# Altium project Hammer.PrjPCB (part 1 of 3)
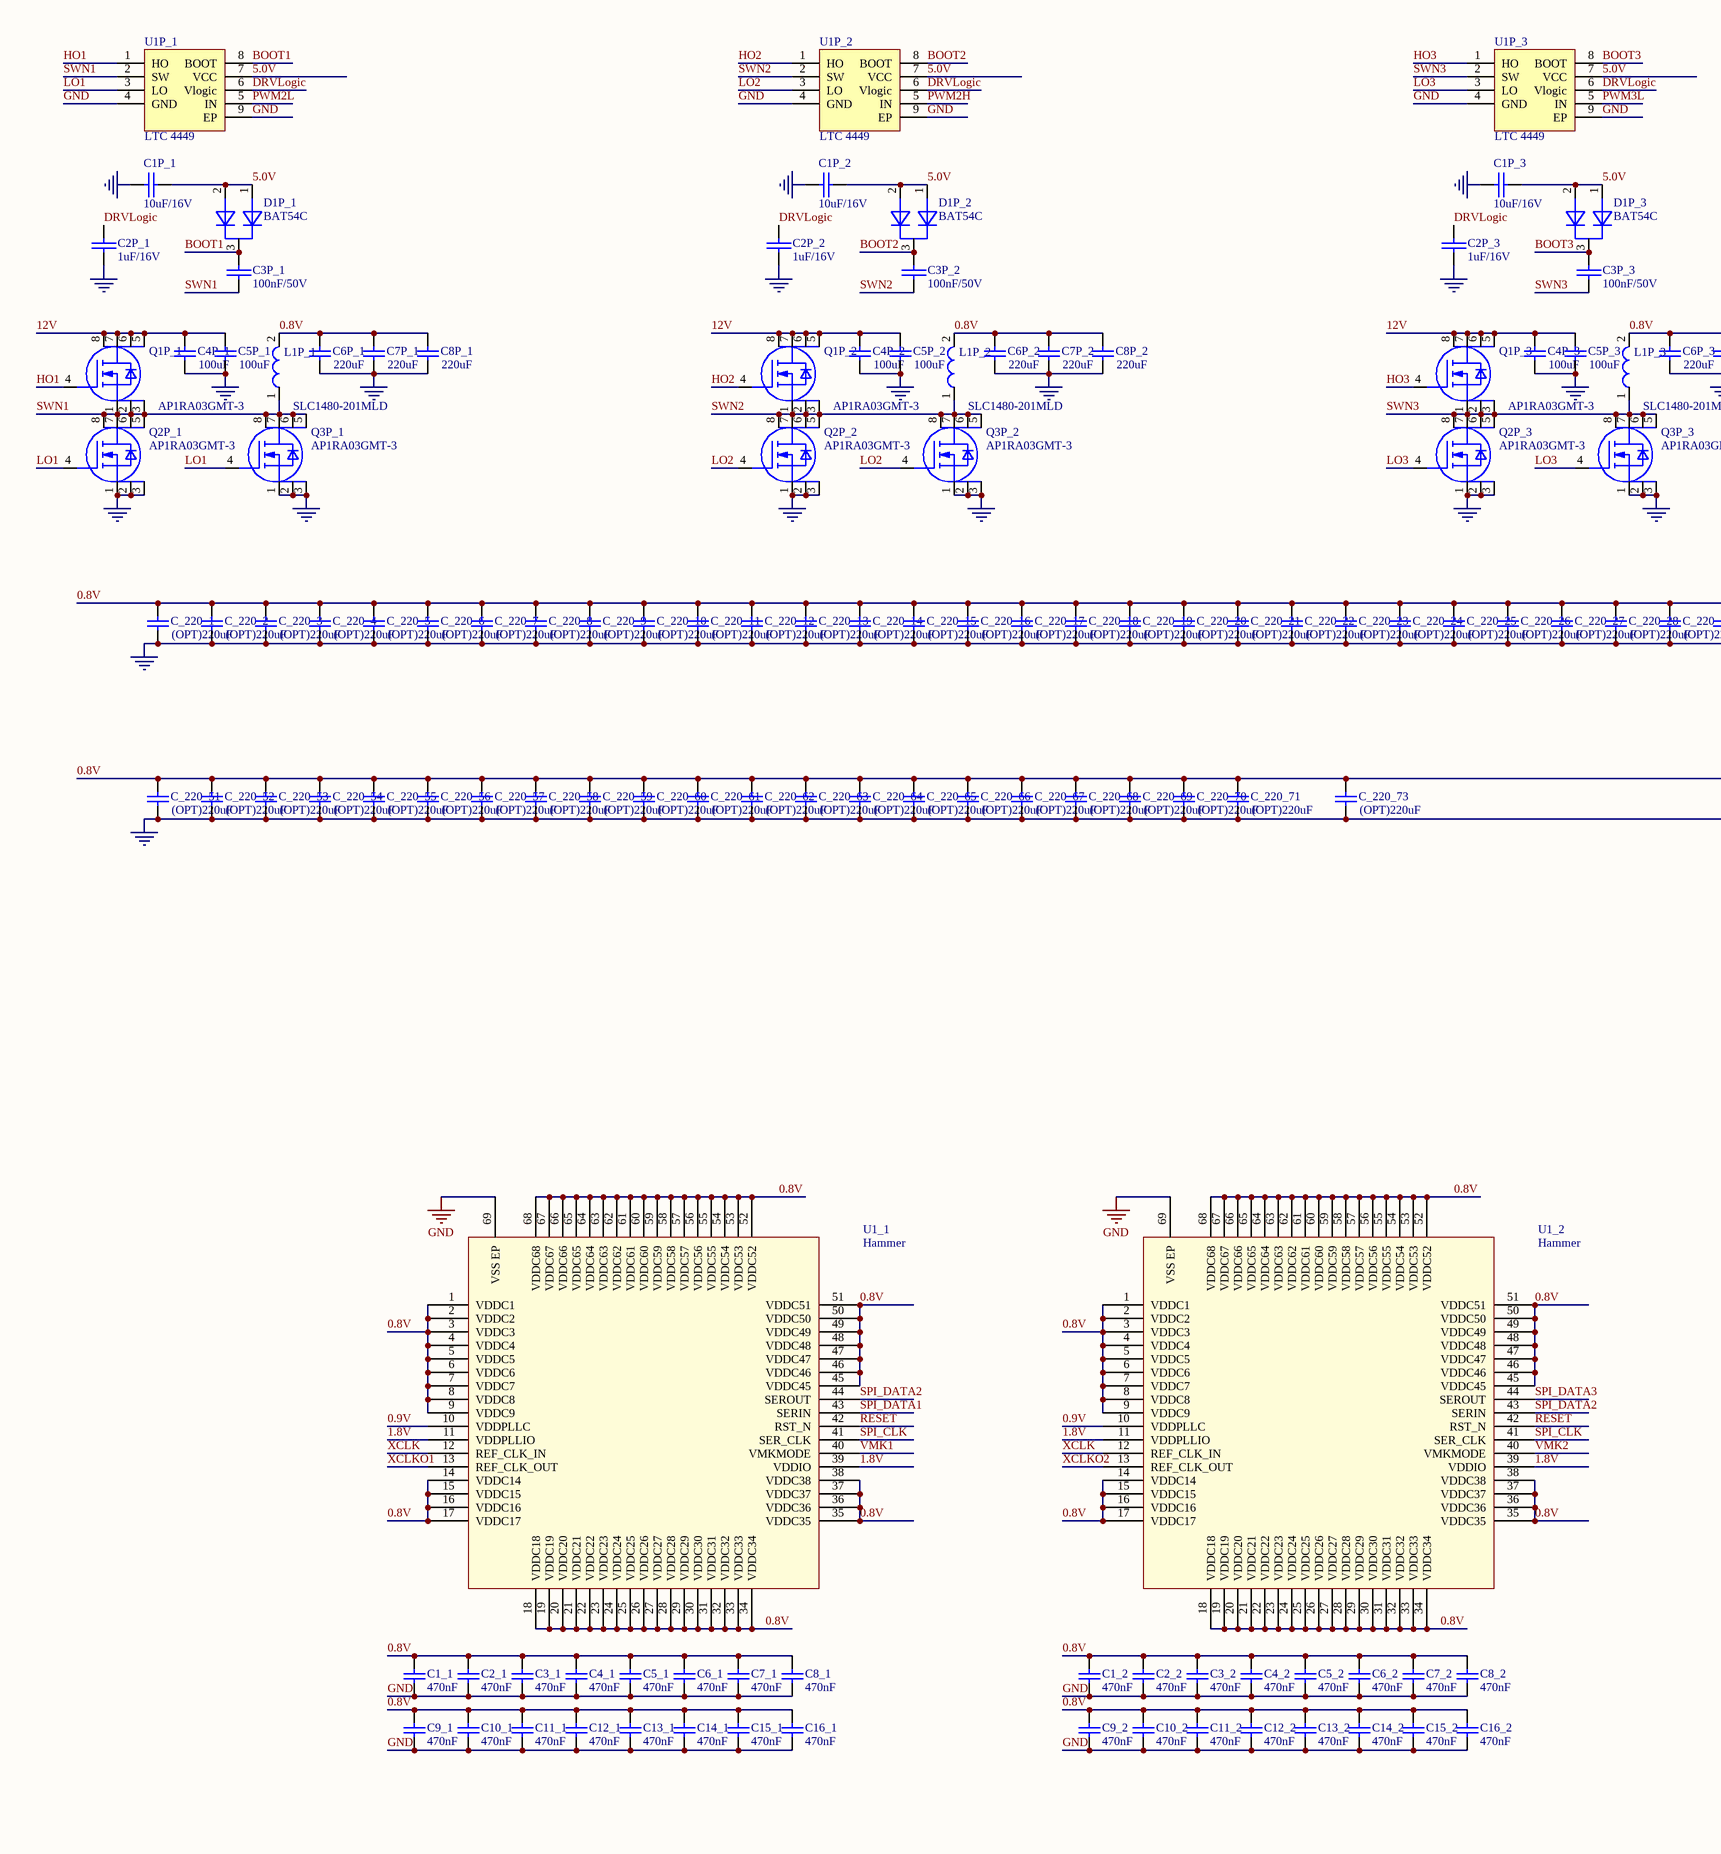
[diagram p0: Hammer.SchDoc, top left]
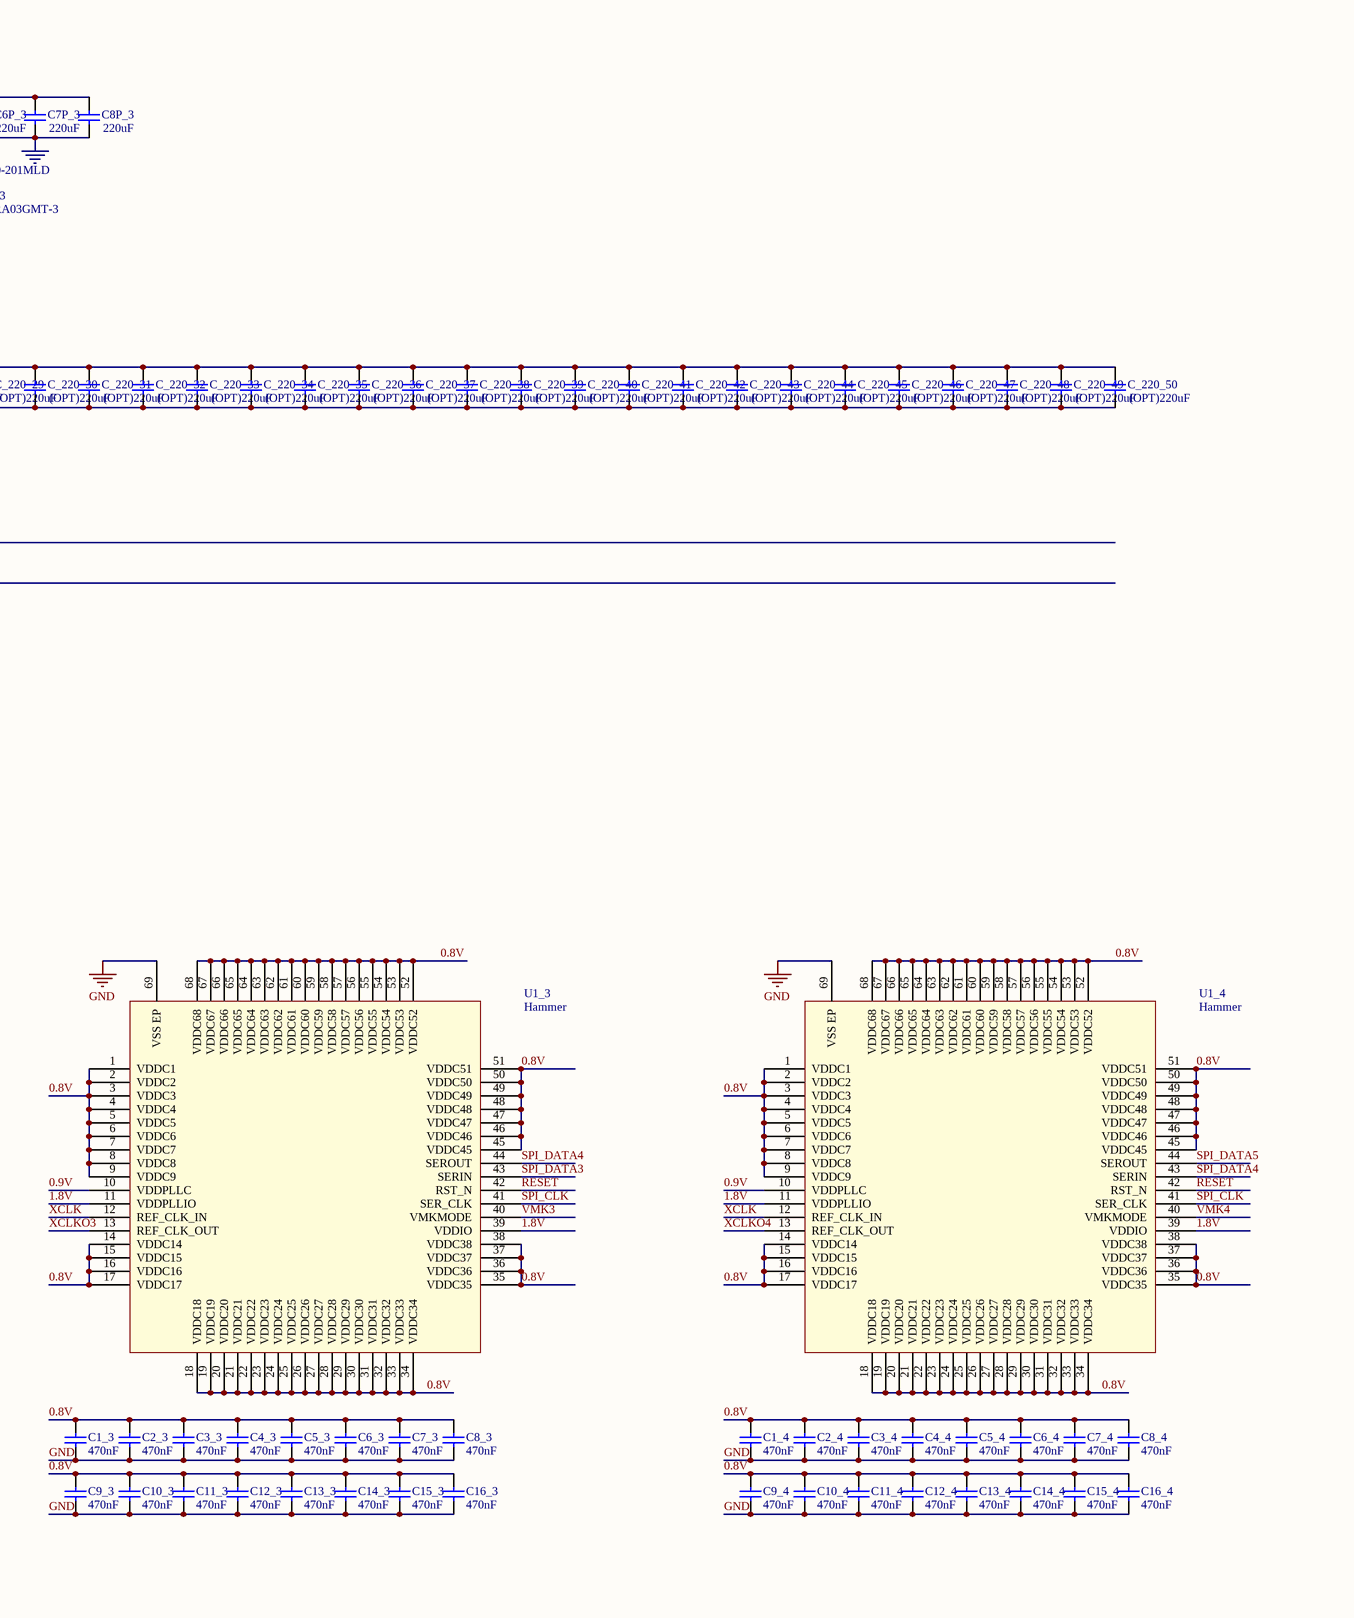
[diagram p1: Hammer.SchDoc, top middle]
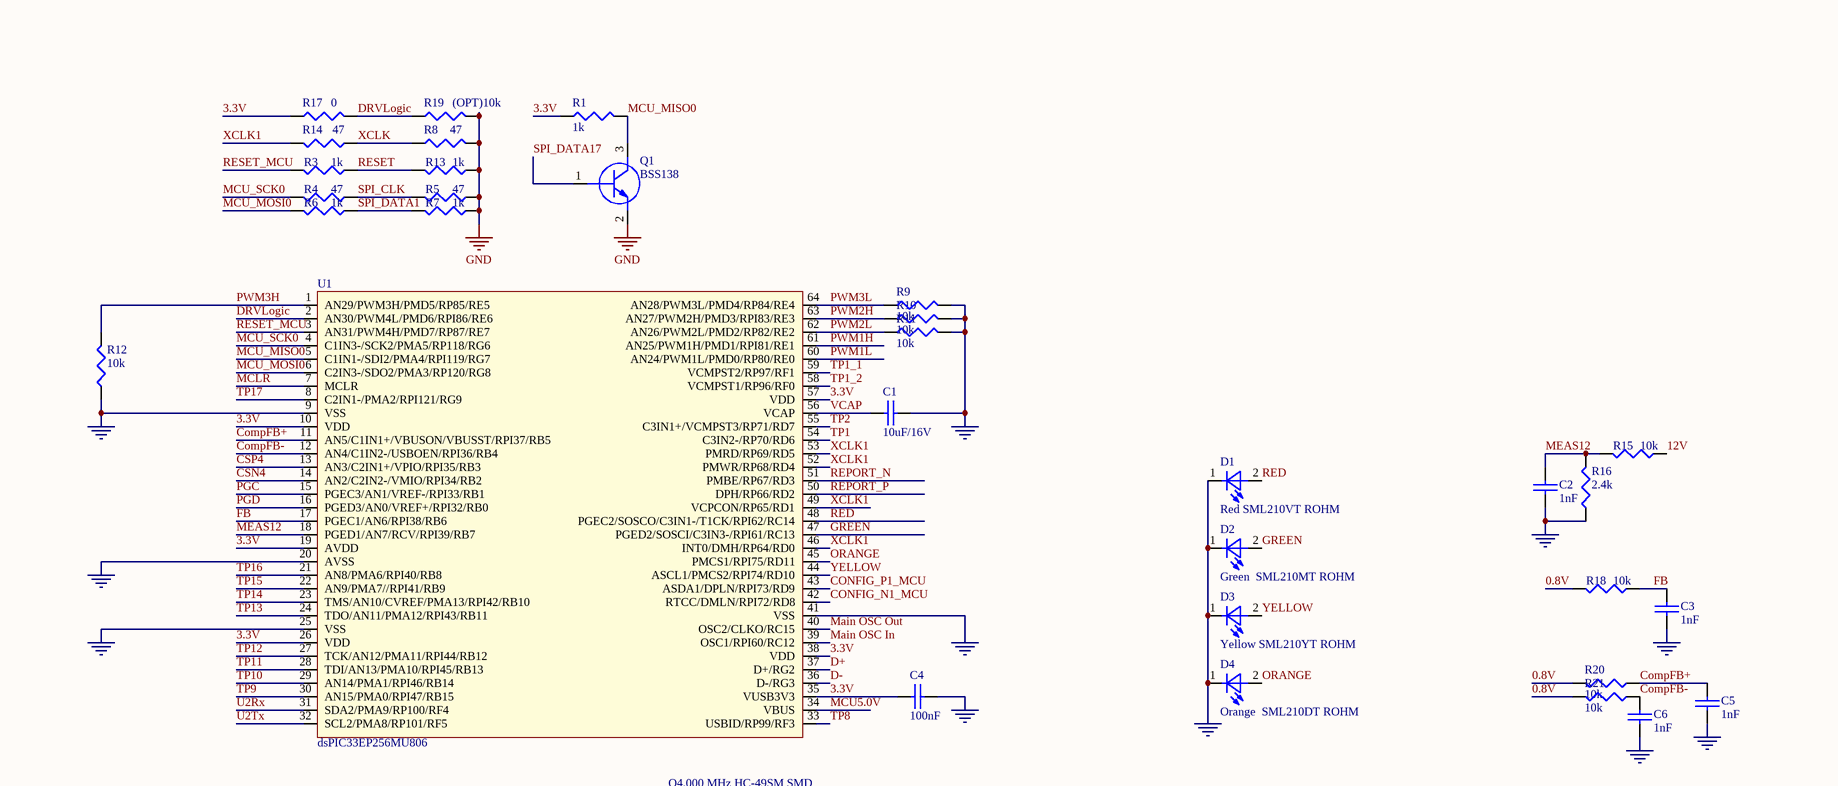
[diagram p2: Hammer.SchDoc, top right]
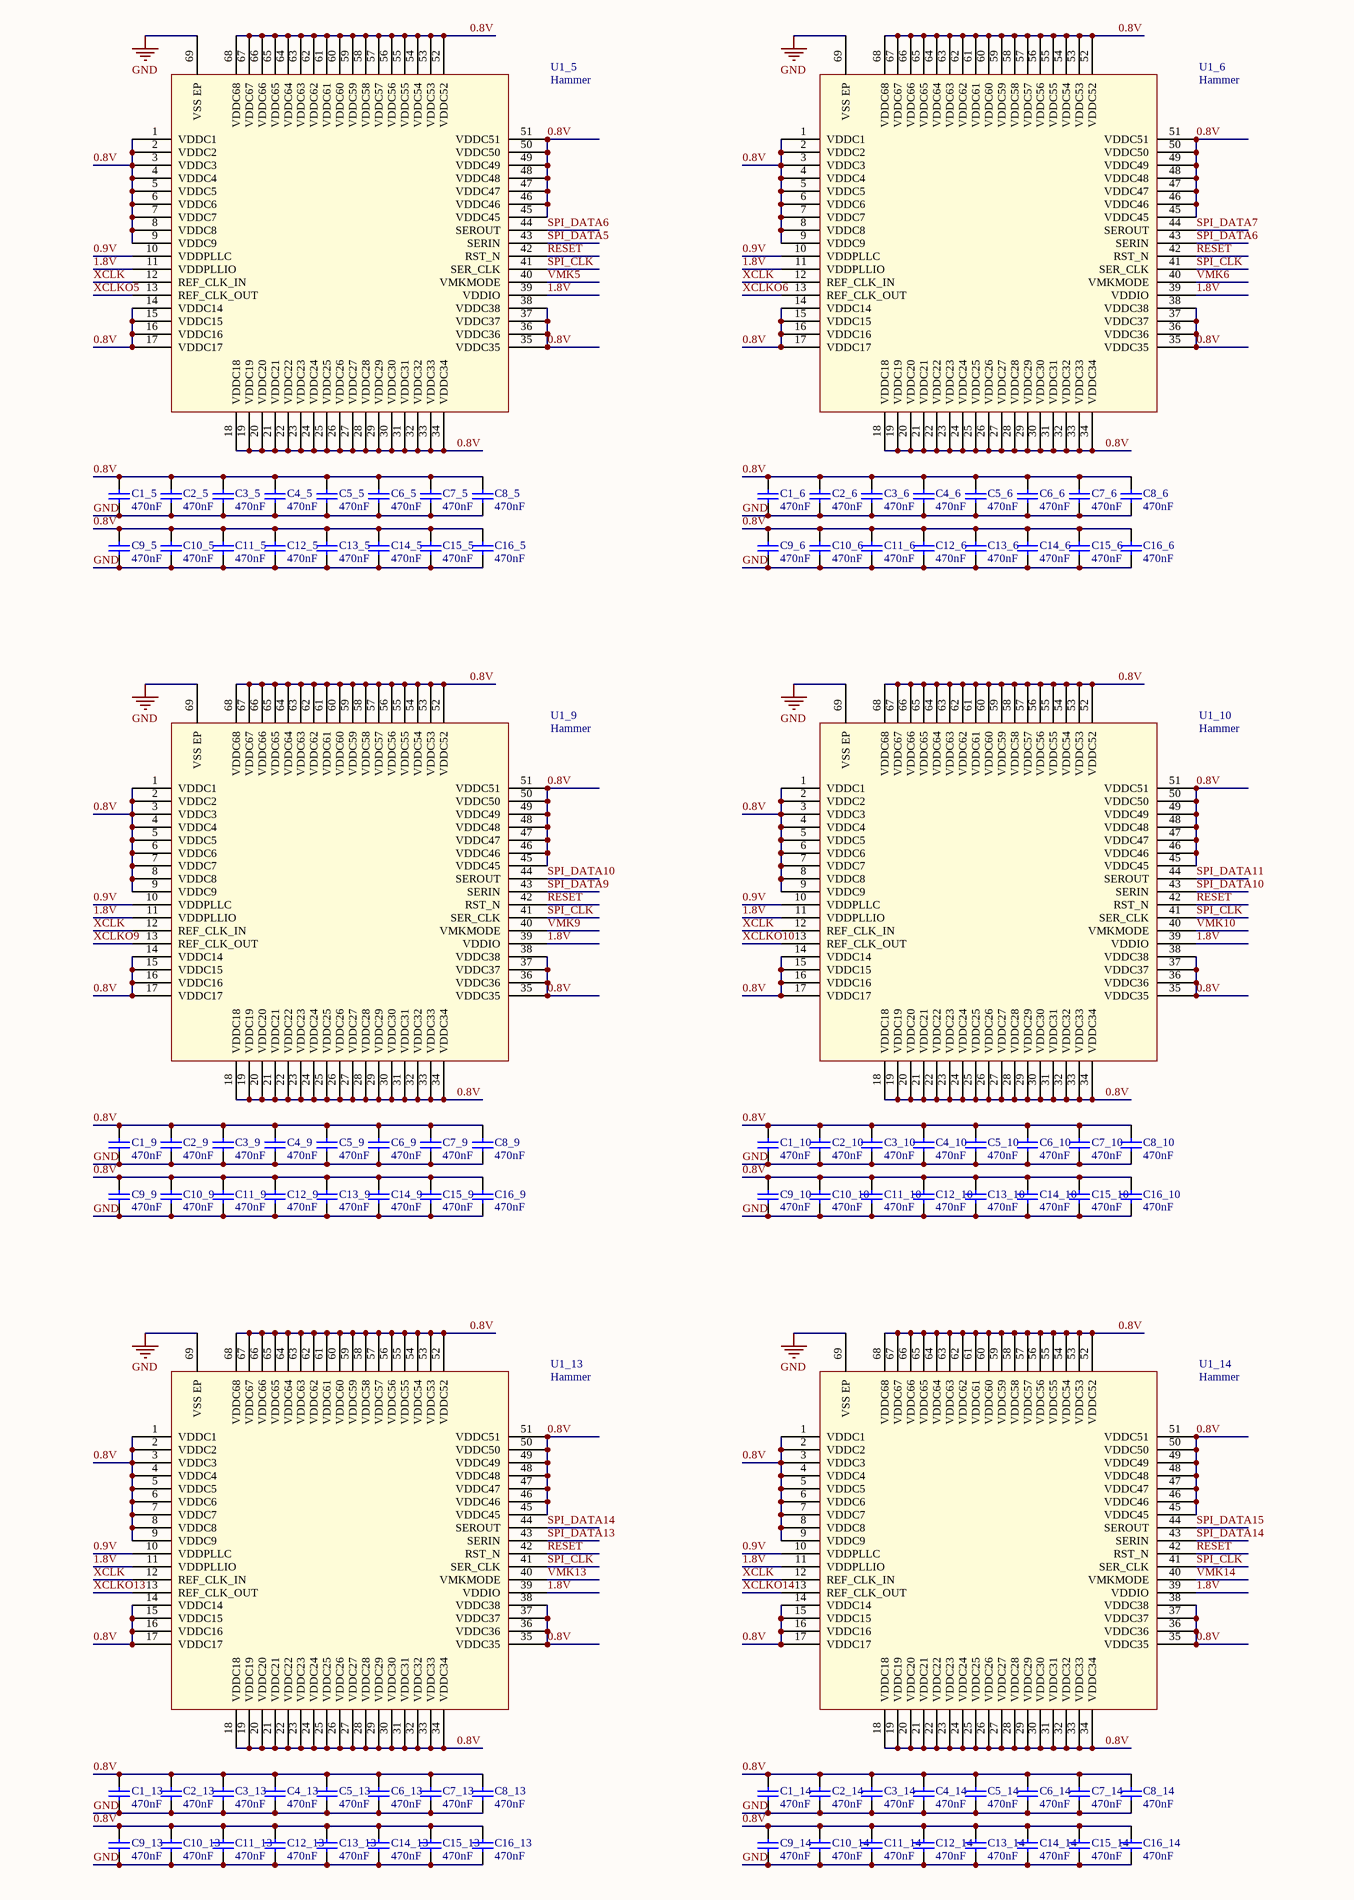
[diagram p3: Hammer.SchDoc, bottom left]
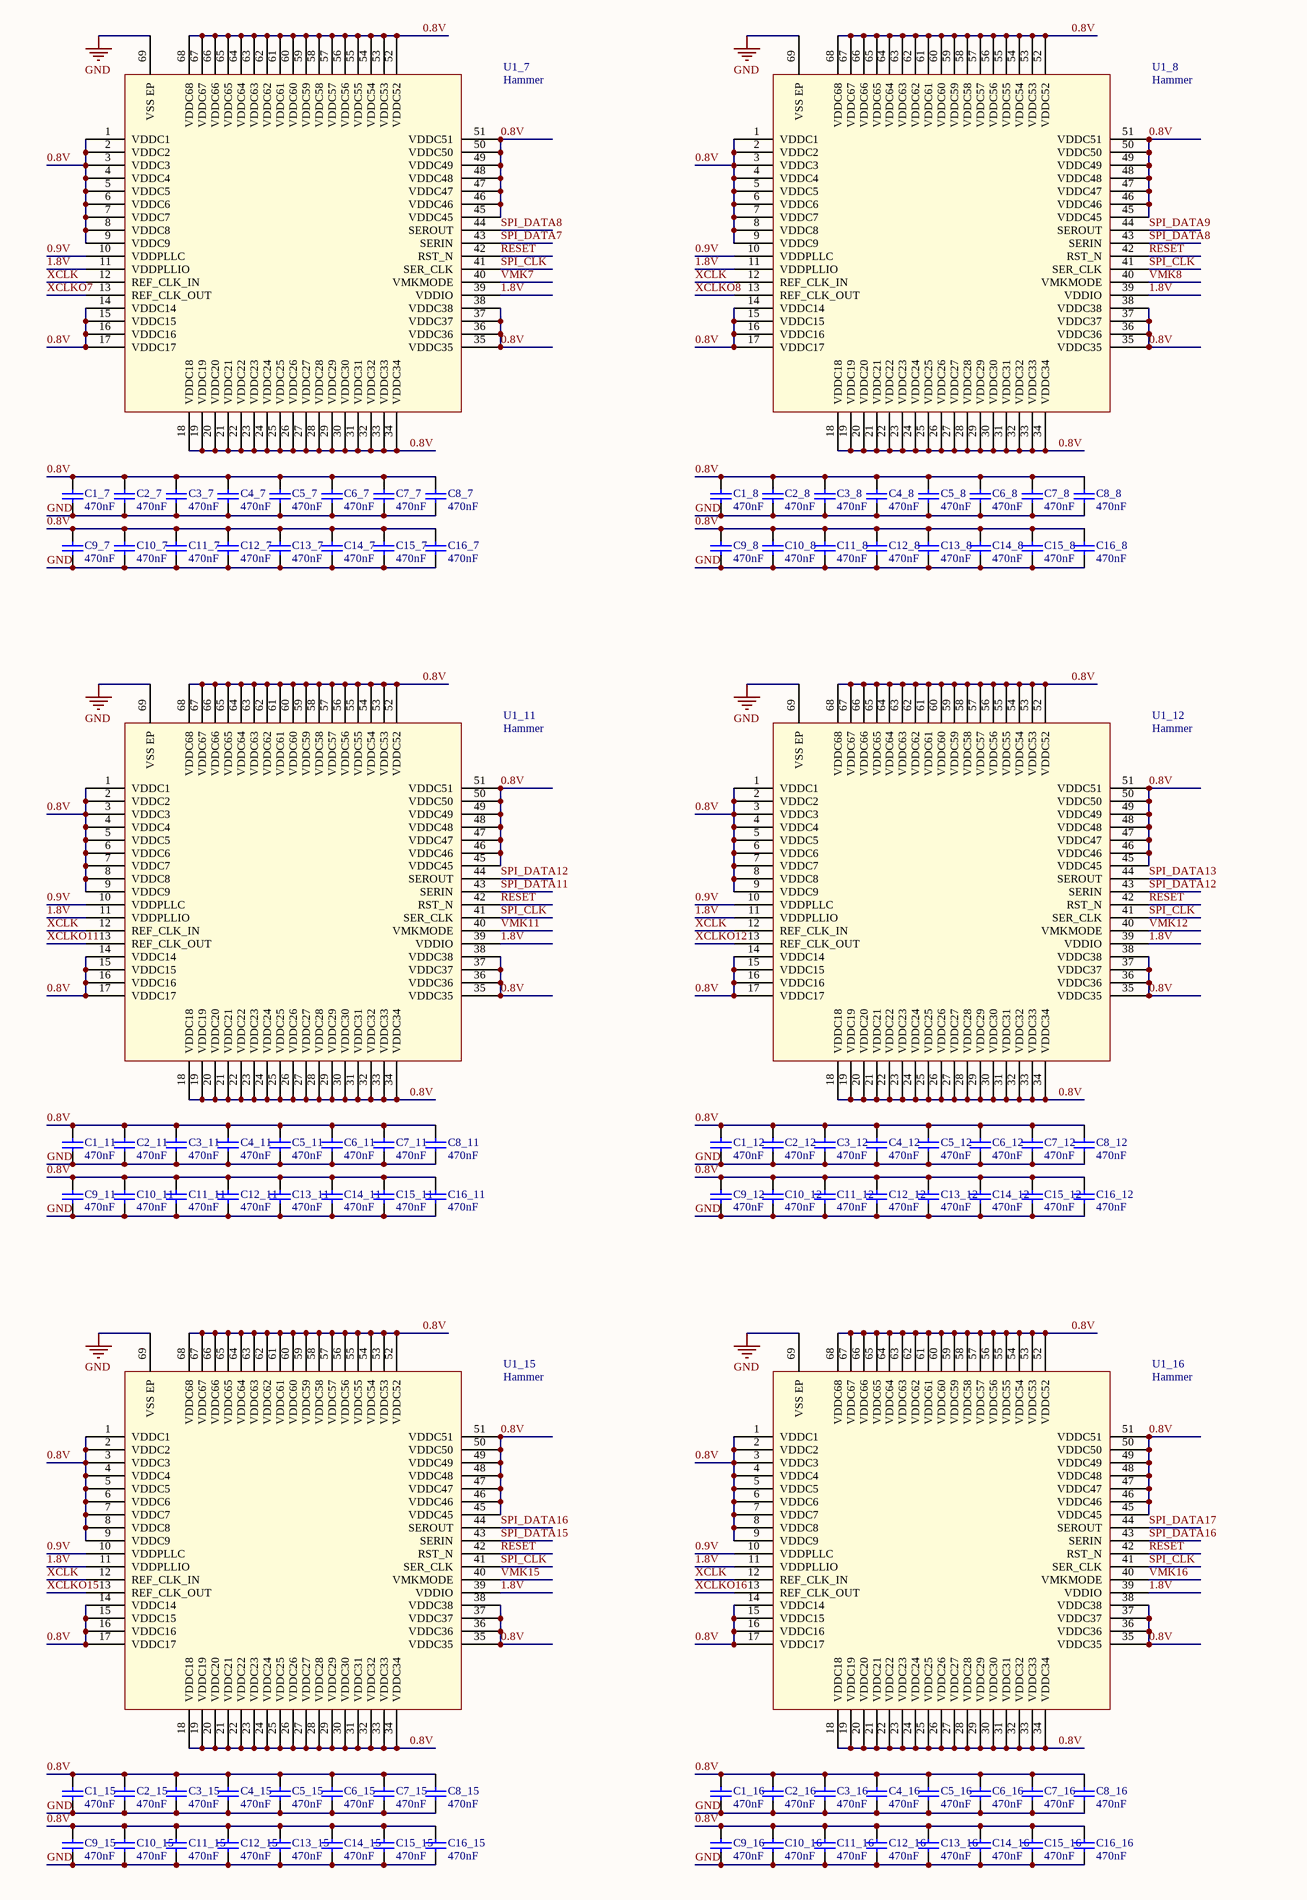
[diagram p4: Hammer.SchDoc, bottom middle]
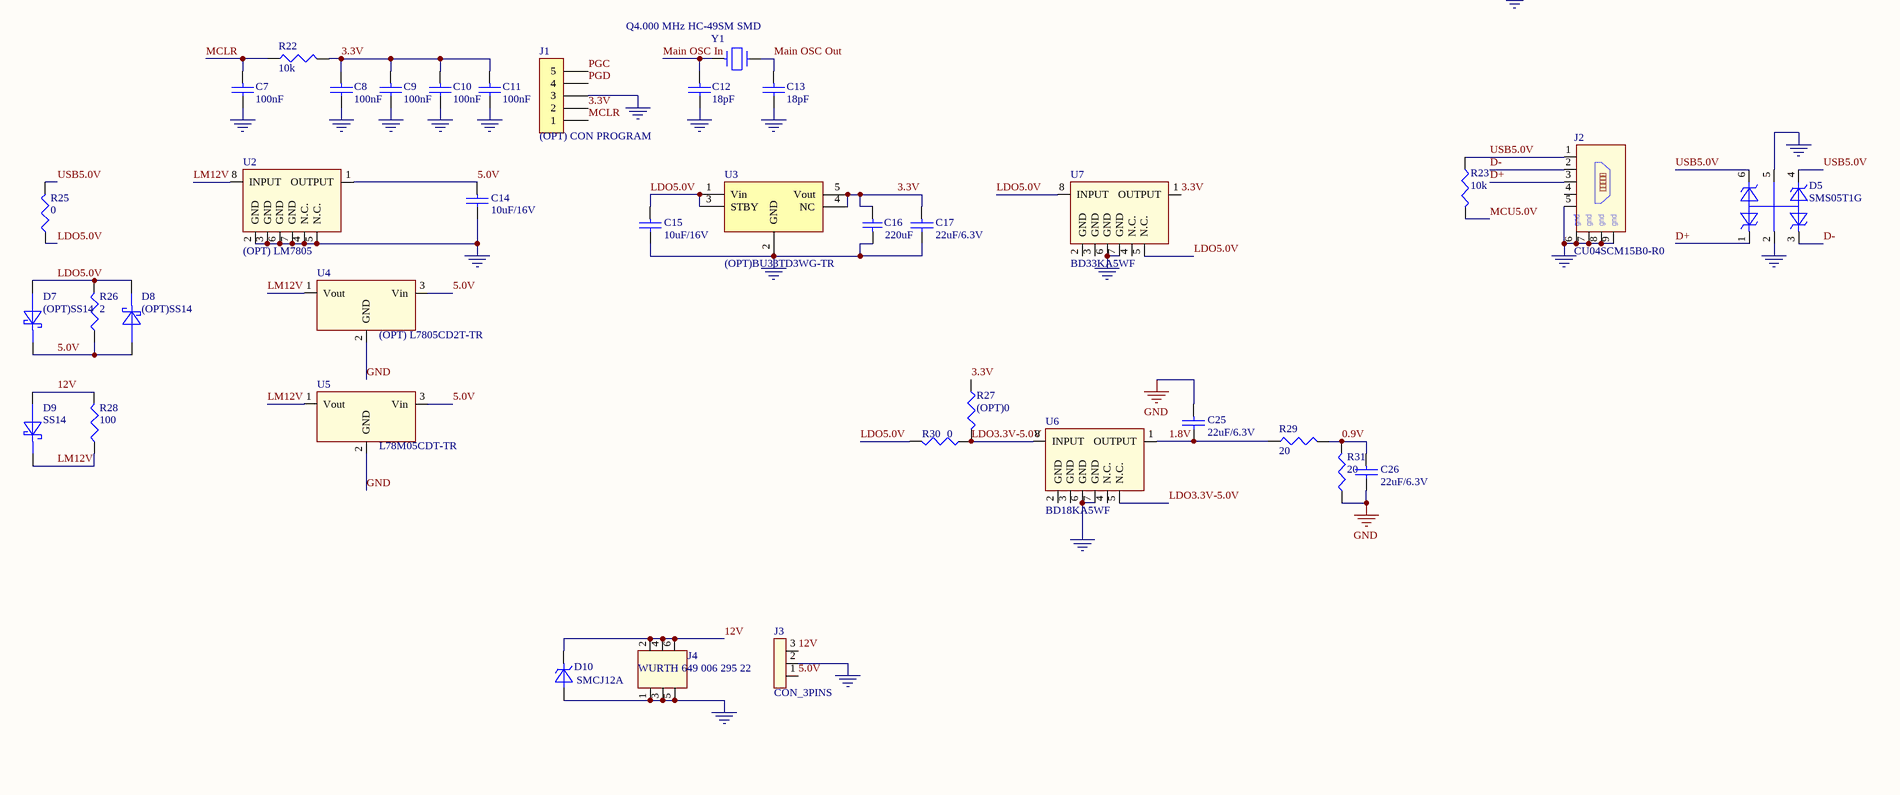
[diagram p5: Hammer.SchDoc, bottom right]
1 sheet, 456 parts. Net scope: flat (ports and power ports of the same name join across sheets).
Board file: Hammer.PcbDoc